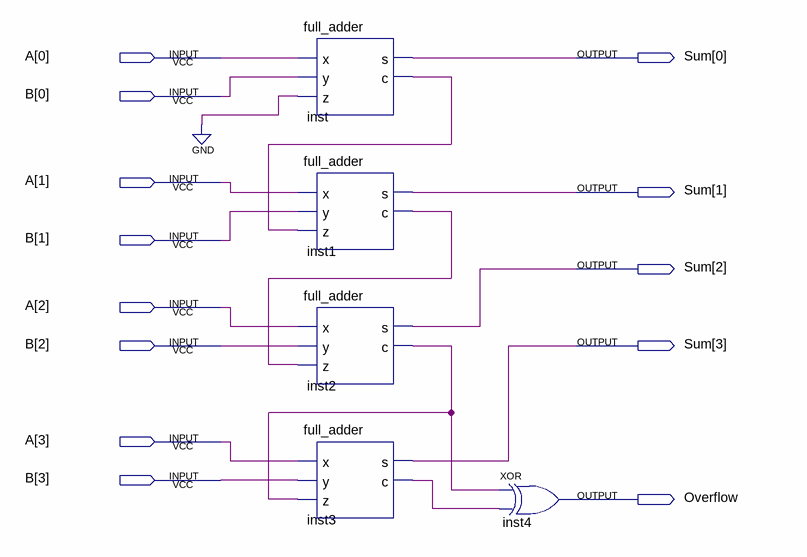
[diagram p0: schematic sheet]
// Quartus schematic four_bit_adder.bdf as structural Verilog: 5 symbols, 13 pins
module four_bit_adder (
  input  [3:0] A,
  input  [3:0] B,
  output [3:0] Sum,
  output Overflow
);

  wire inst1_c, inst2_c, inst3_c, inst_c;

  full_adder inst (.x(A[0]), .y(B[0]), .z(1'b0), .s(Sum[0]), .c(inst_c));
  full_adder inst1 (.x(A[1]), .y(B[1]), .z(inst_c), .s(Sum[1]), .c(inst1_c));
  full_adder inst2 (.x(A[2]), .y(B[2]), .z(inst1_c), .s(Sum[2]), .c(inst2_c));
  full_adder inst3 (.x(A[3]), .y(B[3]), .z(inst2_c), .s(Sum[3]), .c(inst3_c));
  xor inst4 (Overflow, inst2_c, inst3_c);
endmodule
